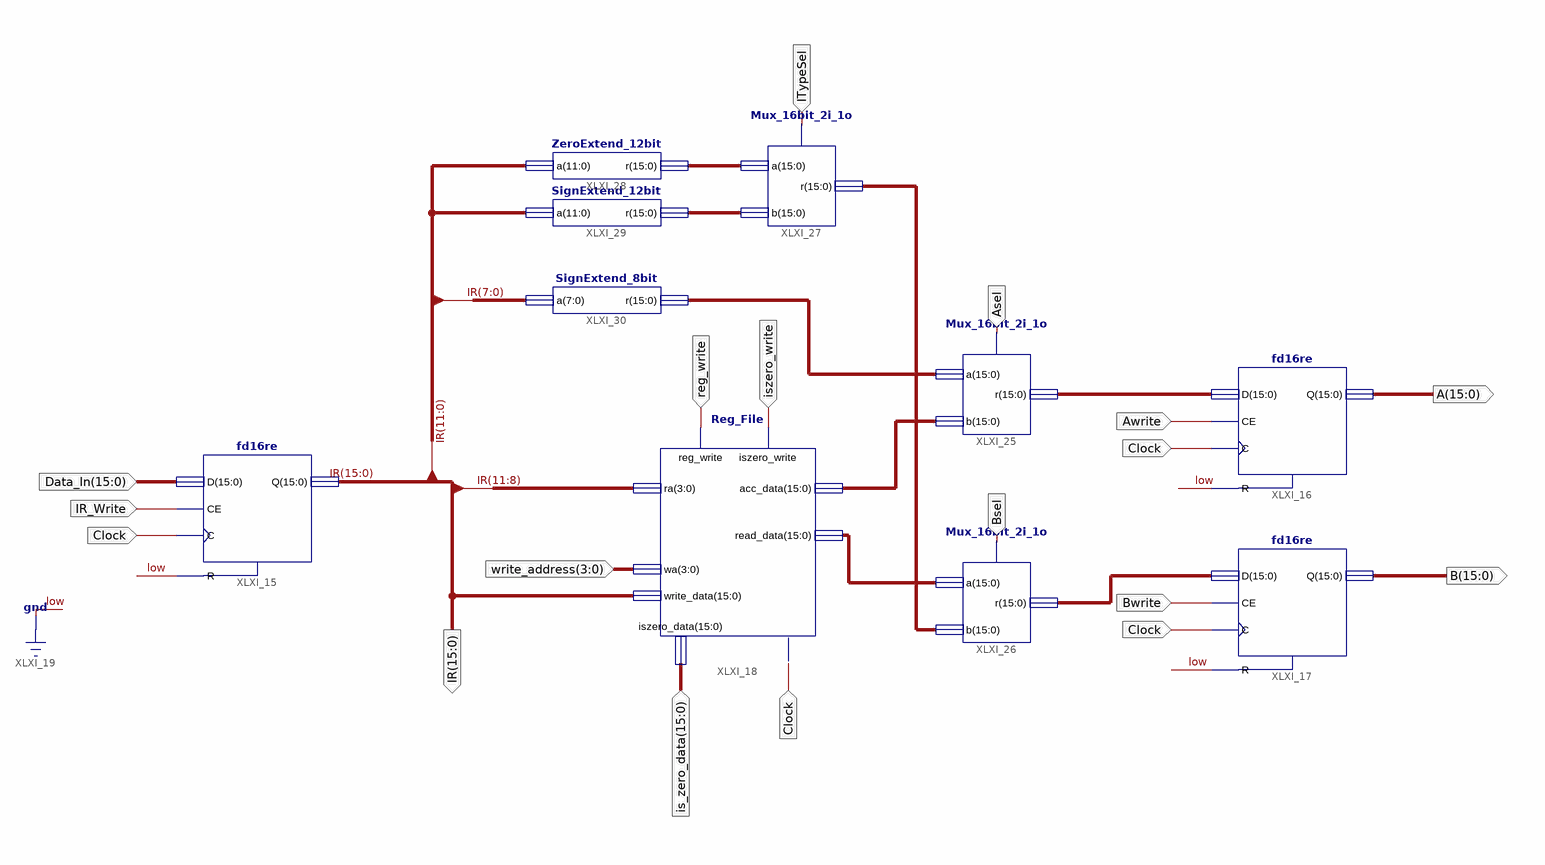
[diagram p0: schematic sheet 1]
// Xilinx ISE schematic Processor_integration_2.sch (spartan3e) as structural Verilog: 10 symbols, 15 ports
module Processor_integration_2 (
  input  reg_write,
  input  iszero_write,
  input  [3:0] write_address,
  input  [15:0] Data_In,
  input  IR_Write,
  input  Clock,
  input  [15:0] is_zero_data,
  input  Awrite,
  input  Bwrite,
  input  Asel,
  input  Bsel,
  input  ITypeSel,
  output [15:0] IR,
  output [15:0] A,
  output [15:0] B
);

  wire [15:0] XLXN_45, XLXN_46, XLXN_47, XLXN_48, XLXN_53, XLXN_56, XLXN_57, XLXN_61;

  fd16re XLXI_15 (.C(Clock), .CE(IR_Write), .D(Data_In), .R(1'b0), .Q(IR));
  fd16re XLXI_16 (.C(Clock), .CE(Awrite), .D(XLXN_47), .R(1'b0), .Q(A));
  fd16re XLXI_17 (.C(Clock), .CE(Bwrite), .D(XLXN_45), .R(1'b0), .Q(B));
  Reg_File XLXI_18 (
    .clock(Clock), .reg_write(reg_write), .iszero_write(iszero_write), .ra(IR[11:8]), .wa(write_address),
    .write_data(IR), .iszero_data(is_zero_data), .acc_data(XLXN_48), .read_data(XLXN_46));
  Mux_16bit_2i_1o XLXI_25 (.b(XLXN_48), .r(XLXN_47), .s(Asel), .a(XLXN_61));
  Mux_16bit_2i_1o XLXI_26 (.b(XLXN_53), .r(XLXN_45), .s(Bsel), .a(XLXN_46));
  Mux_16bit_2i_1o XLXI_27 (.b(XLXN_57), .r(XLXN_53), .s(ITypeSel), .a(XLXN_56));
  ZeroExtend_12bit XLXI_28 (.a(IR[11:0]), .r(XLXN_56));
  SignExtend_12bit XLXI_29 (.a(IR[11:0]), .r(XLXN_57));
  SignExtend_8bit XLXI_30 (.a(IR[7:0]), .r(XLXN_61));
endmodule
